# Altium schematic sheet Charge.SchDoc
size A; SheetNumber: 1; SheetTotal: 1
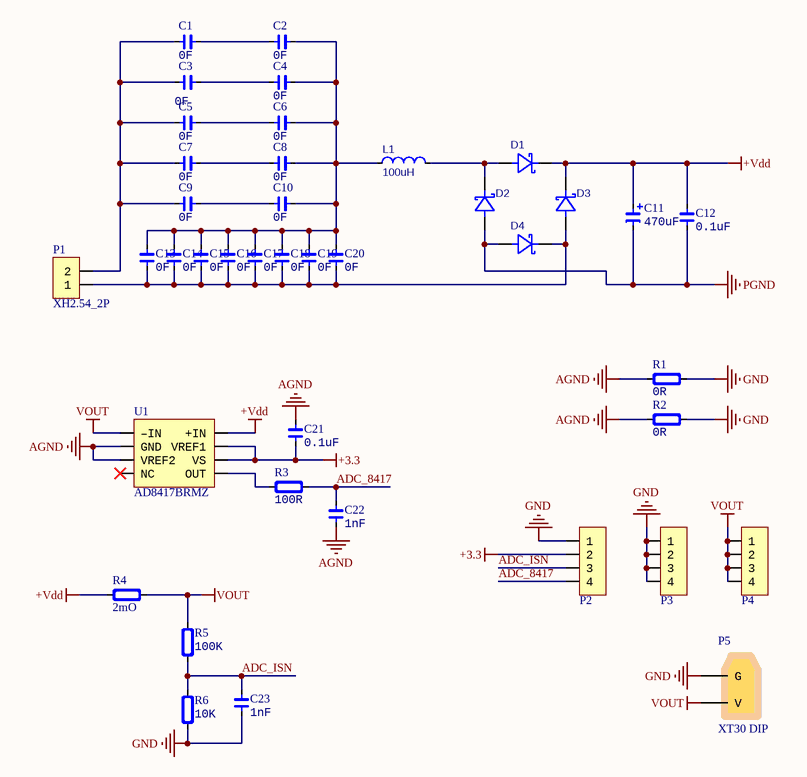
[diagram p0: Charge.SchDoc]

## Parts
C1  0F  [1206_CAP]
C2  0F  [1206_CAP]
C3  0F  [1206_CAP]
C4  0F  [1206_CAP]
C5  0F  [1206_CAP]
C6  0F  [1206_CAP]
C7  0F  [1206_CAP]
C8  0F  [1206_CAP]
C9  0F  [1206_CAP]
C10  0F  [1206_CAP]
C11  470uF  [CAP-TH_BD8.0-P3.50-D1.0-FD]
C12  0.1uF  [0805_CAP]
C13  0F  [1206_CAP]
C14  0F  [1206_CAP]
C15  0F  [1206_CAP]
C16  0F  [1206_CAP]
C17  0F  [1206_CAP]
C18  0F  [1206_CAP]
C19  0F  [1206_CAP]
C20  0F  [1206_CAP]
C21  0.1uF  [0603_CAP]
C22  1nF  [0603_CAP]
C23  1nF  [0805_CAP]
D1  SK86  [SMC_L7.1-W6.2-LS8.1-R-RD]  (value not drawn)
D2  SK86  [SMC_L7.1-W6.2-LS8.1-R-RD]  (value not drawn)
D3  SK86  [SMC_L7.1-W6.2-LS8.1-R-RD]  (value not drawn)
D4  SK86  [SMC_L7.1-W6.2-LS8.1-R-RD]  (value not drawn)
L1  100uH  [Winding inductance]
P1  XH2.54_2P  [XH2.54_2P]
P2  HDR1x4_2.54  [HDR_1X4]  (value not drawn)
P3  HDR1x4_2.54  [HDR_1X4]  (value not drawn)
P4  HDR1x4_2.54  [HDR_1X4]  (value not drawn)
P5  XT30 DIP  [XT30 DIP]
R1  0R  [0805_RES]
R2  0R  [0805_RES]
R3  100R  [0603_RES]
R4  2mO  [2512_RES]
R5  100K  [0805_RES]
R6  10K  [0805_RES]
U1  AD8417BRMZ  [MSOP-8_L3.0-W3.0-P0.65-LS4.9-BL]

## Nets
+3.3: C21.1 P2.2 U1.6(VS) U1.7(VREF1)
+Vdd: C11.1 C12.2 D1.2 D3.2 R4.1 U1.8(+IN)
AGND: C21.2 C22.1 R1.1 R2.1 U1.2(GND) U1.3(VREF2)
GND: C23.1 P2.1 P3.1 P3.2 P3.3 P3.4 P5.2(G) R1.2 R2.2 R6.1
PGND: C11.2 C12.1 D2.1 D4.1
VOUT: P4.1 P4.2 P4.3 P4.4 P5.1(V) R4.2 R5.2 U1.1(–IN)
ADC_8417: C22.2 P2.4 R3.2
ADC_ISN: C23.2 P2.3 R5.1 R6.2
NetC1_1: C1.1 C3.1 C5.1 C7.1 C9.1 P1.2
NetC1_2: C1.2 C2.1
NetC2_2: C2.2 C4.2 C6.2 C8.2 C10.2 C13.2 C14.2 C15.2 C16.2 C17.2 C18.2 C19.2 C20.2 L1.1
NetC3_2: C3.2 C4.1
NetC5_2: C5.2 C6.1
NetC7_2: C7.2 C8.1
NetC9_2: C9.2 C10.1
NetC13_1: C13.1 C14.1 C15.1 C16.1 C17.1 C18.1 C19.1 C20.1 D3.1 D4.2 P1.1
NetD1_1: D1.1 D2.2 L1.2
NetR3_1: R3.1 U1.5(OUT)

Not connected (* = marked no-connect by the designer): U1 4(NC)*

## Library data of the parts
C1-C10 C13-C20 = 1206_CAP: Capacitor; Specification: X7R 50V; Manufacturer: *
C11 = CAP_8x11.5: Electrolytic capacitor
C12 C23 = 0805_CAP: Capacitor; Specification: X7R 50V; Manufacturer: *
C21 C22 = 0603_CAP: Capacitor; Specification: X7R 50V; Manufacturer: *
D1-D4 = SK86: BOM_Manufacturer: Yangzhou Yangjie Elec Tech; BOM_Manufacturer Part: SS86; Contributor: LCSC; BOM_Supplier: LCSC; BOM_Supplier Part: C698827; spicePre: D; spiceSymbolName: SS86
L1 = IND: Inductor; BOM_Manufacturer: microgate; BOM_Manufacturer Part: MPIT6045-330M-LF; nameAlias: Inductance; Contributor: LCSC; BOM_Supplier: LCSC; BOM_Supplier Part: C696490; spicePre: L; spiceSymbolName: MPIT6045-330M-LF
P2-P4 = HDR1x4_2.54: Header
P5 = XT30 DIP: XT30 板载直头直插
R1 R2 R5 R6 = 0805_RES: Resistor; Specification: ±5%; Manufacturer: *
R3 = 0603_RES: Resistor; Specification: ±5%; Manufacturer: *
R4 = 2512_RES: Resistor